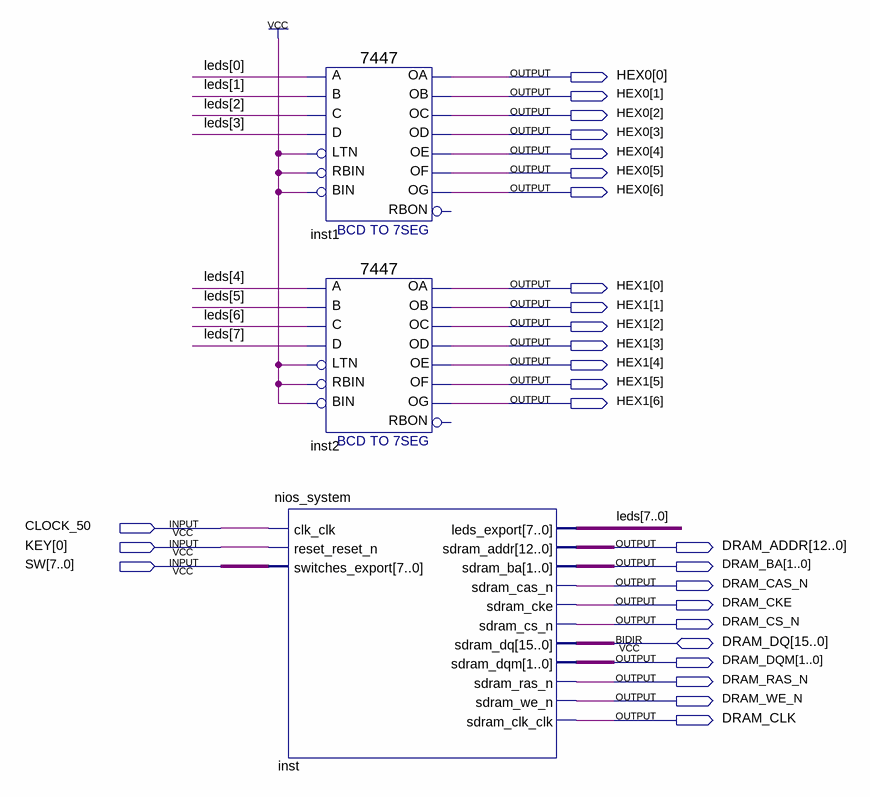
[diagram p0: schematic sheet]
// Quartus schematic lights.bdf as structural Verilog: 3 symbols, 27 pins
module lights (
  input  CLOCK_50,
  input  [0:0] KEY,
  input  [7:0] SW,
  inout  [15:0] DRAM_DQ,
  output [6:0] HEX0,
  output [6:0] HEX1,
  output [12:0] DRAM_ADDR,
  output [1:0] DRAM_BA,
  output DRAM_CAS_N,
  output DRAM_CKE,
  output DRAM_CS_N,
  output [1:0] DRAM_DQM,
  output DRAM_RAS_N,
  output DRAM_WE_N,
  output DRAM_CLK
);

  wire [7:0] leds;

  nios_system inst (
    .clk_clk(CLOCK_50), .reset_reset_n(KEY[0]), .switches_export(SW), .leds_export(leds),
    .sdram_addr(DRAM_ADDR), .sdram_ba(DRAM_BA), .sdram_cas_n(DRAM_CAS_N), .sdram_cke(DRAM_CKE),
    .sdram_cs_n(DRAM_CS_N), .sdram_dqm(DRAM_DQM), .sdram_ras_n(DRAM_RAS_N), .sdram_we_n(DRAM_WE_N),
    .sdram_clk_clk(DRAM_CLK), .sdram_dq(DRAM_DQ));
  \7447  inst1 (
    .LTN(1'b1), .B(leds[1]), .C(leds[2]), .D(leds[3]), .RBIN(1'b1), .BIN(1'b1), .A(leds[0]), .OB(HEX0[1]),
    .OC(HEX0[2]), .OE(HEX0[4]), .OD(HEX0[3]), .OF(HEX0[5]), .OG(HEX0[6]), .OA(HEX0[0]));  // open: RBON
  \7447  inst2 (
    .LTN(1'b1), .B(leds[5]), .C(leds[6]), .D(leds[7]), .RBIN(1'b1), .BIN(1'b1), .A(leds[4]), .OB(HEX1[1]),
    .OC(HEX1[2]), .OE(HEX1[4]), .OD(HEX1[3]), .OF(HEX1[5]), .OG(HEX1[6]), .OA(HEX1[0]));  // open: RBON
endmodule
